# EAGLE board rose (EAGLE 7.5.0)
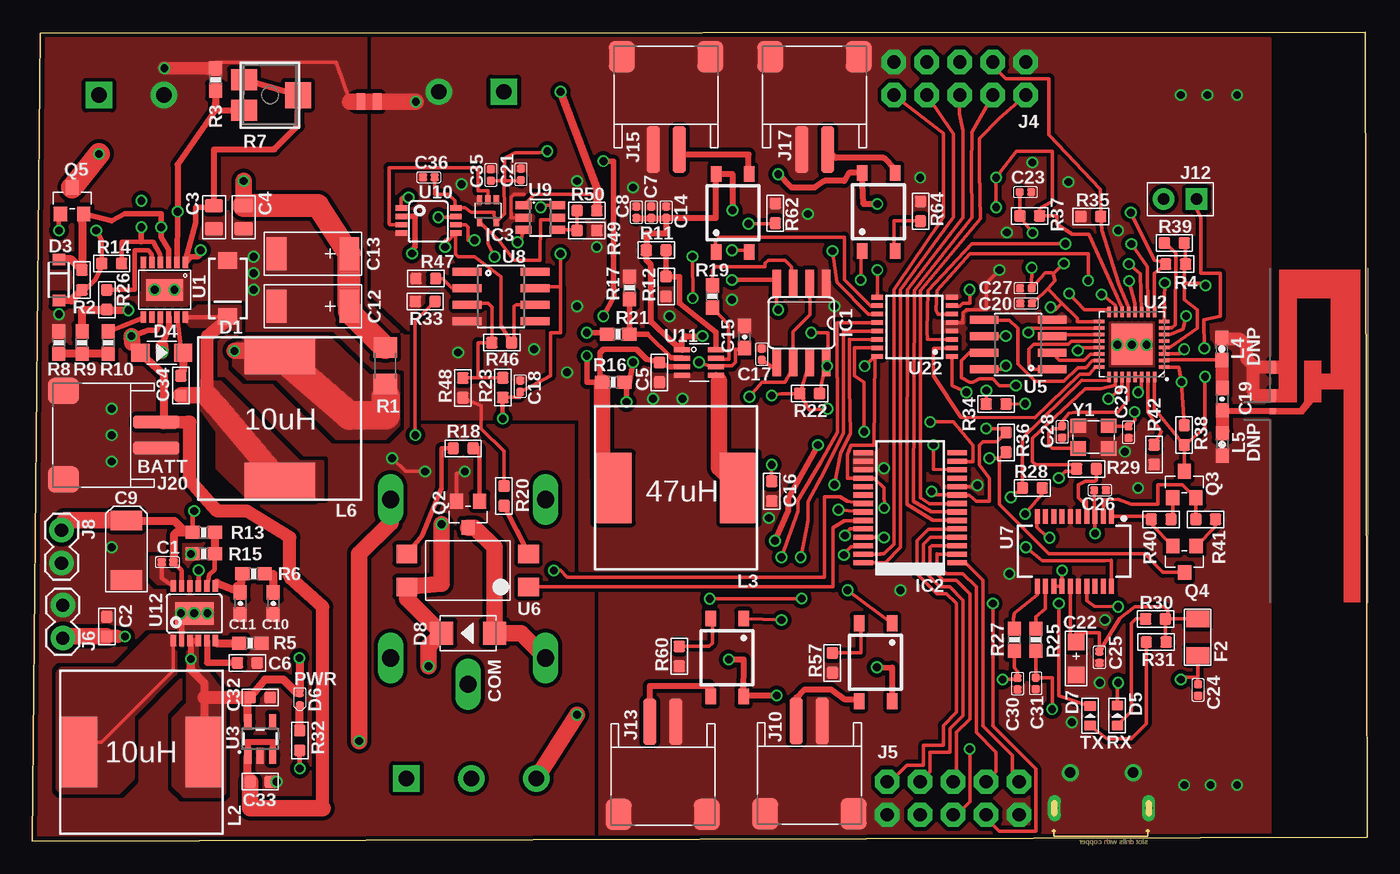
[diagram p2: board, top side]
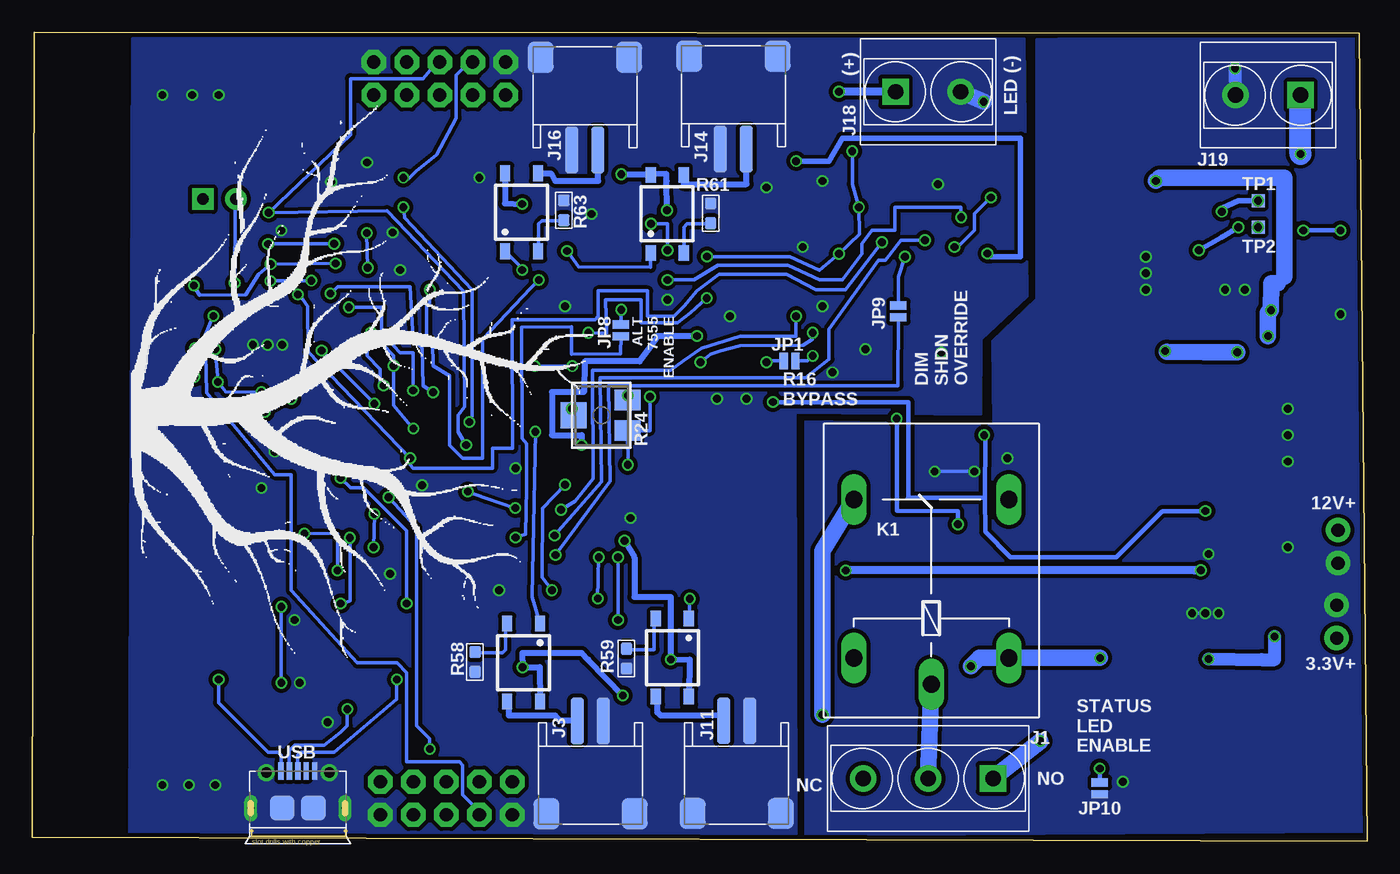
[diagram p3: board, bottom side, seen from below]

Size 102.72 x 62.22 mm. Coordinates in mm from the lower left corner, seen from the top.
Outline: 0,0 102.72,0.3 102.57,62.22 0.61,62.17 0,0
Copper layers (1*16): Top 0.035mm / dielectric 1.5mm / Bottom 0.035mm
Design rules "SeeedStudio_2layer_DRU_no_angle_20140221": minimum track width 6mil, minimum drill 12mil, track to track 6mil, track to pad 6mil, pad to pad 6mil, via to via 6mil, smd to smd 0mil, copper to edge 10mil, drill to drill 10mil, minimum pad ring 10mil, minimum via ring 6mil, stop-mask expansion 2mil, vias tented up to drill 100mil, thermal gap 10mil

## Footprints (pad centres in the part's own frame; a part is rotated, then mirrored left to right if it is on the bottom)
C0402 = smd 0.635 x 0.635: 1 0,0.445; 2 0,-0.445
C0603 = smd 0.889 x 0.889: 1 0,0.762; 2 0,-0.762
C0805 = smd 1.397 x 1.016: 1 0,0.889; 2 0,-0.889
EIA6032 = smd 1.5 x 2.4: P$1 -2.3,0; P$2 2.3,0
0603-CAP = smd 1.1 x 1: 1 -0.85,0; 2 0.85,0
AVX-C = smd 1.524 x 2.54: + -2.794,0; - 2.794,0
AVX-A = smd 1.27 x 1.27: + -1.27,0; - 1.27,0
SMA-DIODE = smd 1.27 x 1.47: A -2.15,0; C 2.15,0
SOD-123 = smd 0.9 x 0.95: A 1.575,0; C -1.575,0
SOD-123' = smd 1.397 x 1.397: + -1.651,0; - 1.651,0
LED-0603 = smd 0.762 x 0.889: + -0.762,0; - 0.762,0
LED-0402 = smd 0.58 x 0.58: + -0.468,0; - 0.468,0
DO-214AC = smd 1.8 x 1.77: 1 -2.042,0; 2 2.042,0
TRACE_ANTENNA_2.4GHZ_25.7MM = smd 0.46 x 0.46: ANT 0,0.23 | smd 1 x 0.46: GND -1.18,0.23; GND2 -3.38,0.23
F1206 = smd 1.27 x 1.778: 1 -1.397,0; 2 1.397,0
SO08 = smd 0.66 x 2.032: 1 -1.905,-3.073; 2 -0.635,-3.073; 3 0.635,-3.073; 4 1.905,-3.073; 5 1.905,3.073; 6 0.635,3.073; 7 -0.635,3.073; 8 -1.905,3.073
SSOP28 = smd 0.4 x 1.5: 1 -4.225,-3.625; 2 -3.575,-3.625; 3 -2.925,-3.625; 4 -2.275,-3.625; 5 -1.625,-3.625; 6 -0.975,-3.625; 7 -0.325,-3.625; 8 0.325,-3.625; 9 0.975,-3.625; 10 1.625,-3.625; 11 2.275,-3.625; 12 2.925,-3.625; 13 3.575,-3.625; 14 4.225,-3.625; 15 4.225,3.625; 16 3.575,3.625; 17 2.925,3.625; 18 2.275,3.625; 19 1.625,3.625; 20 0.975,3.625; 21 0.325,3.625; 22 -0.325,3.625; 23 -0.975,3.625; 24 -1.625,3.625; 25 -2.275,3.625; 26 -2.925,3.625; 27 -3.575,3.625; 28 -4.225,3.625
SC70-5 = smd 0.4 x 0.7: 1 -0.65,-0.85; 2 0,-0.85; 3 0.65,-0.85; 4 0.65,0.85; 5 -0.65,0.85
H3-5.0-15.5X8.0MM = drill 1.168 pad 2.032 square: 1 0,5 | drill 1.168 pad 2.032: 2 0,0; 3 0,-5
HW2-SMD-2.0-90D = smd 2 x 2.4: 3 3.4,-2.181; 4 -3.4,-2.181 | smd 1 x 3.6: + -1,4.953; - 1,4.953
2X5_NOSILK = drill 1.016 pad 1.88 octagon: 1 -1.27,5.08; 2 1.27,5.08; 3 -1.27,2.54; 4 1.27,2.54; 5 -1.27,0; 6 1.27,0; 7 -1.27,-2.54; 8 1.27,-2.54; 9 -1.27,-5.08; 10 1.27,-5.08
1X02 = drill 1.016 pad 1.88: 1 0,0; 2 2.54,0
H2-2.54 = drill 0.889 pad 1.651 square: 1 0,1.27 | drill 0.889 pad 1.651: 2 0,-1.27
H2-5.0-10.5X8.0MM = drill 1.168 pad 2.032 square: 1 0,2.5 | drill 1.168 pad 2.032: 2 0,-2.5
PAD-JUMPER-2-NO_NO_SILK = smd 0.635 x 1.27: 1 -0.45,0; 2 0.45,0
G5LE = drill 1.321 long: 1 -7.493,-5.969; 2 -7.493,5.969; O 4.699,5.969; P -9.525,0; S 4.699,-5.969
SRR1240 = smd 2.896 x 5.41: P$1 -4.851,0; P$2 4.851,0
0603 = smd 1.1 x 1: 1 -0.85,0; 2 0.85,0
2PT_GND_TIE = smd 1.27 x 0.635: P$1 0,0.635; P$2 0,-0.635
SOT-23 = smd 1.016 x 1.143: 1 -0.889,-1.016; 2 0.889,-1.016; 3 0,1.016
1206 = smd 1.6 x 1.8: 1 -1.4,0; 2 1.4,0
R0603 = smd 0.889 x 0.889: 1 0,0.762; 2 0,-0.762
0603-RES = smd 1.1 x 1: 1 -0.85,0; 2 0.85,0
ST4ETA = smd 2 x 1.6: P$1 2,-1.175; P$3 2,1.175 | smd 2 x 2: P$2 -2.15,0
TP10SQ = smd 1 x 1: TP 0,0
MSOP-12_GND = smd 0.889 x 0.42: 1 -2.1,1.625; 2 -2.1,0.975; 3 -2.1,0.325; 4 -2.1,-0.325; 5 -2.1,-0.975; 6 -2.1,-1.625; 7 2.1,-1.625; 8 2.1,-0.975; 9 2.1,-0.325; 10 2.1,0.325; 11 2.1,0.975; 12 2.1,1.625 | smd 1.651 x 2.845: 13 0,0
QFN32 = smd 0.8 x 0.285: 1 -2.5,1.75; 2 -2.5,1.25; 3 -2.5,0.75; 4 -2.5,0.25; 5 -2.5,-0.25; 6 -2.5,-0.75; 7 -2.5,-1.25; 8 -2.5,-1.75; 17 2.5,-1.75; 18 2.5,-1.25; 19 2.5,-0.75; 20 2.5,-0.25; 21 2.5,0.25; 22 2.5,0.75; 23 2.5,1.25; 24 2.5,1.75 | smd 0.285 x 0.8: 9 -1.75,-2.5; 10 -1.25,-2.5; 11 -0.75,-2.5; 12 -0.25,-2.5; 13 0.25,-2.5; 14 0.75,-2.5; 15 1.25,-2.5; 16 1.75,-2.5; 25 1.75,2.5; 26 1.25,2.5; 27 0.75,2.5; 28 0.25,2.5; 29 -0.25,2.5; 30 -0.75,2.5; 31 -1.25,2.5; 32 -1.75,2.5 | smd 3.15 x 3.15: EP 0,0
SOT23-5 = smd 0.55 x 1.2: 1 -0.95,-1.3; 2 0,-1.3; 3 0.95,-1.3; 4 0.95,1.3; 5 -0.95,1.3
SO08' = smd 0.61 x 2.21: 1 -1.905,-2.616; 2 -0.635,-2.616; 3 0.635,-2.616; 4 1.905,-2.616; 5 1.905,2.616; 6 0.635,2.616; 7 -0.635,2.616; 8 -1.905,2.616
SMD4-2.54-4.6X6.5MM = smd 1.4 x 1.6: 1 -1.27,-4.68; 2 1.27,-4.68; 3 1.27,4.68; 4 -1.27,4.68
SSOP20_L = smd 0.381 x 1.143: 1 -2.857,-2.68; 2 -2.223,-2.68; 3 -1.587,-2.68; 4 -0.953,-2.68; 5 -0.318,-2.68; 6 0.318,-2.68; 7 0.953,-2.68; 8 1.587,-2.68; 9 2.223,-2.68; 10 2.857,-2.68; 11 2.857,2.68; 12 2.223,2.68; 13 1.587,2.68; 14 0.953,2.68; 15 0.318,2.68; 16 -0.318,2.68; 17 -0.953,2.68; 18 -1.587,2.68; 19 -2.223,2.68; 20 -2.857,2.68
SOIC-8 = smd 0.61 x 2.21: 1 -1.905,-2.616; 2 -0.635,-2.616; 3 0.635,-2.616; 4 1.905,-2.616; 5 1.905,2.616; 6 0.635,2.616; 7 -0.635,2.616; 8 -1.905,2.616
TSOT-23-6 = smd 0.62 x 1.22: 1 -0.925,-1.325; 2 0.025,-1.325; 3 0.975,-1.325; 4 0.975,1.275; 5 0.025,1.275; 6 -0.925,1.275
TSSOP-8 = smd 0.419 x 0.889: 1 -0.975,-2.1; 2 -0.325,-2.1; 3 0.325,-2.1; 4 0.975,-2.1; 5 0.975,2.1; 6 0.325,2.1; 7 -0.325,2.1; 8 -0.975,2.1
TSOT-23-8 = smd 0.4 x 1.22: 1 -0.975,-1.31; 2 -0.325,-1.31; 3 0.325,-1.31; 4 0.975,-1.31; 5 0.975,1.31; 6 0.325,1.31; 7 -0.325,1.31; 8 -0.975,1.31
12MSOP = smd 0.419 x 0.889: 1 -1.61,-2.1; 2 -0.96,-2.1; 3 -0.31,-2.1; 4 0.34,-2.1; 5 0.988,-2.1; 6 1.635,-2.1; 7 1.635,2.1; 8 0.988,2.1; 9 0.34,2.1; 10 -0.31,2.1; 11 -0.96,2.1; 12 -1.61,2.1 | smd 2.946 x 1.75: 13 0.025,0
4-SOP = smd 0.8 x 1.2: 1 -1.143,-3.152; 2 1.397,-3.152; 3 1.397,2.848; 4 -1.143,2.848
TSSOP-16 = smd 0.9 x 0.35: 1 -2.697,2.453; 2 -2.697,1.803; 3 -2.697,1.153; 4 -2.697,0.503; 5 -2.697,-0.147; 6 -2.697,-0.797; 7 -2.697,-1.447; 8 -2.697,-2.097; 9 3.053,-2.097; 10 3.053,-1.447; 11 3.053,-0.797; 12 3.053,-0.147; 13 3.053,0.503; 14 3.053,1.153; 15 3.053,1.803; 16 3.053,2.453
MICRO-USB5+6P-SMD-0.65-AB = smd 0.4 x 1.35: 1 -1.3,2.875; 2 -0.65,2.875; 3 0,2.875; 4 0.65,2.875; 5 1.3,2.875 | smd 1.9 x 1.9: P1 -1.2,0; P2 1.2,0 | drill 0.508 pad 1.016 long: P3 -3.625,0; P4 3.625,0 | drill 0.8: P5 -2.425,2.73; P6 2.425,2.73
CRYSTAL-SMD-3.2X2.5 = smd 1.2 x 1.1: 1 -1.175,-0.875; 2 1.175,-0.875; 3 1.175,0.875; 4 -1.175,0.875

## Placement (x,y rotation side)
C1  100nf  [C0402]  10.39,21.46 270 top
C2  4.7uf  [C0603]  5.71,16.51 0 top
C3  10uf  [C0805]  13.97,48.01 180 top
C4  10uf  [C0805]  16.26,48.01 180 top
C5  1uf  [C0603]  48.26,36.07 180 top
C6  4.7uf  [C0603]  16.54,13.72 270 top
C7  1nf  [C0402]  47.62,48.39 0 top
C8  1nf  [C0402]  46.48,48.39 0 top
C9  68uF  [EIA6032]  7.24,22.38 270 top
C10  1.2nF  [0603-CAP]  18.54,18.29 270 top
C11  56pF  [0603-CAP]  16,18.29 270 top
C12  47uf  [AVX-C]  21.59,41.15 180 top
C13  47uf  [AVX-C]  21.59,45.21 180 top
C14  1nf  [C0402]  48.77,48.39 0 top
C15  .47uF 50V X7R  [0603-CAP]  54.81,38.79 90 top
C16  100pf  [C0603]  56.9,26.92 180 top
C17  10nf  [C0402]  56.13,37.47 0 top
C18  100NF 10V  [C0402]  37.54,35 180 top
C19  5.6pF  [0603-CAP]  91.57,34.01 270 top
C20  10uf  [C0402]  76.48,41.38 90 top
C21  100NF 10V  [C0402]  37.59,51.31 0 top
C22  10uf  [AVX-A]  80.34,14.05 270 top
C23  100nf  [C0402]  76.43,49.94 270 top
C24  100nf  [C0402]  89.71,11.63 180 top
C25  100nf  [C0402]  82.12,14.15 180 top
C26  100nf  [C0402]  82.17,27 270 top
C27  100nf  [C0402]  76.45,42.55 90 top
C28  10pf  [C0402]  79.25,31.5 180 top
C29  10pf  [C0402]  84.35,31.47 180 top
C30  47PF  [C0402]  75.82,12.12 0 top
C31  47PF  [C0402]  77.22,12.14 0 top
C32  1uf  [C0603]  17.53,11.05 270 top
C33  1uf  [C0603]  17.53,4.57 270 top
C34  1uf  [C0603]  11.43,35.05 0 top
C35  100NF 10V  [C0402]  35.28,51.26 0 top
C36  100NF 10V  [C0402]  30.51,51.08 270 top
D1  CMSH3-40MA  [SMA-DIODE]  15.04,42.52 270 top
D3  BZT52C10  [SOD-123]  2.03,43.18 270 top
D4  MMSD4148-sod123  [SOD-123']  9.96,37.59 0 top
D5  YELLOW-0603  [LED-0603]  83.49,9.68 90 top
D6  BLUE-0402  [LED-0402]  20.57,10.92 270 top
D7  GREEN-0603  [LED-0603]  81.41,9.65 90 top
D8  1N4007  [DO-214AC]  33.53,16 180 top
E1  ANTENNATRACE  [TRACE_ANTENNA_2.4GHZ_25.7MM]  95.25,33.1 270 top
F2  SMD1206R500SF  [F1206]  89.69,15.7 90 top
IC1  ICM7555  [SO08]  59.18,39.88 180 top
IC2  MCP23017SS  [SSOP28]  67.56,25.65 90 top
IC3  74AHC1G04DCK  [SC70-5]  35.05,48.51 180 top
J1  GREEN-3P-5.0  [H3-5.0-15.5X8.0MM]  33.78,4.83 270 bottom
J3  2P-2.0-90D-SMD  [HW2-SMD-2.0-90D]  59.77,4.29 0 bottom
J4  [2X5_NOSILK]  71.37,58.67 90 top
J5  [2X5_NOSILK]  70.87,3.3 270 top
J6  [1X02]  2.34,15.62 90 top
J8  [1X02]  2.24,23.93 270 top
J10  2P-2.0-90D-SMD  [HW2-SMD-2.0-90D]  59.79,4.29 0 top
J11  2P-2.0-90D-SMD  [HW2-SMD-2.0-90D]  48.51,4.32 0 bottom
J12  2p-2.54  [H2-2.54]  88.34,49.4 270 top
J13  2P-2.0-90D-SMD  [HW2-SMD-2.0-90D]  48.51,4.24 0 top
J14  2P-2.0-90D-SMD  [HW2-SMD-2.0-90D]  48.77,58.22 180 bottom
J15  2P-2.0-90D-SMD  [HW2-SMD-2.0-90D]  48.77,58.17 180 top
J16  2P-2.0-90D-SMD  [HW2-SMD-2.0-90D]  60.2,58.14 180 bottom
J17  2P-2.0-90D-SMD  [HW2-SMD-2.0-90D]  60.2,58.17 180 top
J18  GREEN-2P-5.0  [H2-5.0-10.5X8.0MM]  33.78,57.66 90 bottom
J19  GREEN-2P-5.0  [H2-5.0-10.5X8.0MM]  7.62,57.4 270 bottom
J20  2P-2.0-90D-SMD  [HW2-SMD-2.0-90D]  4.57,31.24 270 top
JP1  JUMPER-PAD-2-NO  [PAD-JUMPER-2-NO_NO_SILK]  44.45,36.96 0 bottom
JP8  JUMPER-PAD-2-NO  [PAD-JUMPER-2-NO_NO_SILK]  57.43,39.29 90 bottom
JP9  JUMPER-PAD-2-NO  [PAD-JUMPER-2-NO_NO_SILK]  36.07,40.77 90 bottom
JP10  JUMPER-PAD-2-NO  [PAD-JUMPER-2-NO_NO_SILK]  20.57,4.06 90 bottom
K1  G5LE  [G5LE]  33.53,21.59 90 bottom
L2  10uH  [SRR1240]  8.38,6.86 180 top
L3  47uH  [SRR1240]  49.53,27.18 0 top
L4  DNP  [0603]  91.54,37.87 90 top
L5  DNP  [0603]  91.57,30.53 270 top
L6  10uH  [SRR1240]  19.05,32.51 90 top
PT1  2PT_GND_TIE  [2PT_GND_TIE]  25.91,56.9 270 top
Q2  S8050  [SOT-23]  33.53,25.15 180 top
Q3  S9013  [SOT-23]  88.65,27.43 0 top
Q4  S9013  [SOT-23]  88.67,21.69 180 top
Q5  NCE3407A  [SOT-23]  3.05,49.28 0 top
R1  0.05  [1206]  27.15,36.58 90 top
R2  100K  [R0603]  3.81,43.18 180 top
R3  9.09K  [0603-RES]  14.1,58.6 270 top
R4  10K  [R0603]  87.99,44.4 90 top
R5  196k 0.1%  [0603-RES]  16.76,15.24 180 top
R6  154k  [0603-RES]  17.02,20.57 180 top
R7  100K  [ST4ETA]  18.29,57.4 180 top
R8  330k  [0603-RES]  2.03,38.35 270 top
R9  30k  [0603-RES]  3.81,38.35 90 top
R10  221k  [0603-RES]  5.84,38.35 270 top
R11  100K  [R0603]  48.01,45.47 270 top
R12  10K  [R0603]  48.77,42.67 0 top
R13  1.02M  [0603-RES]  13.18,23.75 180 top
R14  10K  [R0603]  6.1,44.45 270 top
R15  113k  [0603-RES]  13.18,22.1 0 top
R16  4.7  [0603-RES]  44.7,35.31 0 top
R17  16.5k  [0603-RES]  45.95,42.57 270 top
R18  510R  [R0603]  33.15,30.23 90 top
R19  9.09k  [0603-RES]  52.32,41.91 90 top
R20  1K  [R0603]  36.3,26.57 180 top
R21  453k  [0603-RES]  45.09,39.01 180 top
R22  30K  [R0603]  59.82,34.44 270 top
R23  3.3K  [R0603]  36.2,34.9 0 top
R24  100K  [ST4ETA]  58.93,32.77 0 bottom
R25  27  [0603-RES]  77.22,15.49 90 top
R26  10K  [R0603]  5.71,41.66 0 top
R27  27  [0603-RES]  75.57,15.49 90 top
R28  1K  [R0603]  76.96,27.18 270 top
R29  1K  [R0603]  81.13,28.65 270 top
R30  1K  [R0603]  86.44,17.09 90 top
R31  1K  [R0603]  86.49,15.32 90 top
R32  220R  [R0603]  20.57,7.75 180 top
R33  10K  [R0603]  30.23,41.53 270 top
R34  220R  [R0603]  74.17,33.63 90 top
R35  10K  [R0603]  81.46,48.06 90 top
R36  10K  [R0603]  74.93,30.68 180 top
R37  10K  [R0603]  76.76,48.11 270 top
R38  10K  [R0603]  88.65,31.24 180 top
R39  10K  [R0603]  87.88,46.02 90 top
R40  10K  [R0603]  86.87,24.77 90 top
R41  10K  [R0603]  90.3,24.77 90 top
R42  12K  [R0603]  86.33,29.74 0 top
R46  3.3K  [R0603]  36.12,38.35 90 top
R47  3.3K  [R0603]  30.28,43.28 270 top
R48  10K  [R0603]  33.12,34.87 180 top
R49  3.3K  [R0603]  42.67,46.99 90 top
R50  6.8K  [R0603]  42.67,48.51 90 top
R57  3.3K  [R0603]  61.57,13.72 180 top
R58  3.3K  [R0603]  68.66,13.79 180 bottom
R59  3.3K  [R0603]  57,14.05 180 bottom
R60  3.3K  [R0603]  49.78,14.22 180 top
R61  3.3K  [R0603]  50.52,48.31 0 bottom
R62  3.3K  [R0603]  57.18,48.31 0 top
R63  3.3K  [R0603]  61.82,48.54 0 bottom
R64  3.3K  [R0603]  68.35,48.46 0 top
TP1  TPTP10SQ  [TP10SQ]  8.38,49.28 90 bottom
TP2  TPTP10SQ  [TP10SQ]  8.38,47.24 90 bottom
U1  LT3652  [MSOP-12_GND]  10.16,42.42 270 top
U2  ESP8266  [QFN32]  84.61,38.23 180 top
U3  3.3V  [SOT23-5]  17.53,7.87 0 top
U5  AT25SF041-SOIC8  [SO08']  75.87,38.2 90 top
U6  LTV-816S  [SMD4-2.54-4.6X6.5MM]  33.5,20.83 90 top
U7  FTS31XS-U  [SSOP20_L]  80.19,22.3 180 top
U8  LTC6240  [SOIC-8]  36.07,41.91 270 top
U9  LT1783  [TSOT-23-6]  39.12,48.01 270 top
U10  74LVC2G02  [TSSOP-8]  30.48,47.75 270 top
U11  LT3469  [TSOT-23-8]  51.31,36.83 270 top
U12  LTC3122EP  [12MSOP]  12.45,17.53 0 top
U21  TLP170D  [4-SOP]  65.02,13.61 180 top
U22  74HC238  [TSSOP-16]  68.07,39.75 180 top
U23  TLP170D  [4-SOP]  64.8,13.59 180 bottom
U24  TLP170D  [4-SOP]  53.34,13.97 180 bottom
U25  TLP170D  [4-SOP]  53.59,13.97 180 top
U26  TLP170D  [4-SOP]  54,48.41 0 bottom
U27  TLP170D  [4-SOP]  53.77,48.49 0 top
U28  TLP170D  [4-SOP]  65.2,48.54 0 bottom
U29  TLP170D  [4-SOP]  65,48.56 0 top
U$1  [LEAF]  57.4,60.2 270 top
USB  ZX62-B-5PA  [MICRO-USB5+6P-SMD-0.65-AB]  82.3,2.54 0 bottom
Y1  26MHz  [CRYSTAL-SMD-3.2X2.5]  81.66,31.09 180 top

## Tracks (layer width: path | path; a pad name or v marks a point on that pad's centre or on a via)
3.3V_F  (via drill 0.6)
  Top 0.254: U7.13 U7.14 79.25,19.89 v79.25,20.83 | C26.2 81.75,25.01 U7.3 81.78,24.12 v81.79,23.67
  Bottom 0.254: v81.79,23.67 79.25,23.65 v79.25,20.83
!CHRG  (via drill 0.6)
  Top 0.356: R14.1 6.86,46.13 8.38,46.13 9.3,46.13 9.83,45.13 U1.4
  Top 0.406: TP2.TP 8.38,46.13
  other vias: 8.38,47.24
!FAULT
  Top 0.356: U1.5 9.2,44.51 9.2,45.16 8.89,45.47 7.87,45.47 7.87,42.42 R26.1
ADC  (via drill 0.6)
  Top 0.254: U2.6 87.63,38.99 88.53,39.38 v88.8,40.41
  Bottom 0.254: v88.8,40.41 89.41,38.91 89.31,34.52 84.07,28.19 82.8,28.19 82.8,19.3 77.72,13.72 74.65,13.72 73.91,12.95 73.91,6.1 69.85,6.1 69.6,5.84 69.6,3.56 68.33,2.29 J5.8
BOOST
  Top 0.356: C34.1 11.35,35.89 | D4.- 11.39,38.07 U1.11
  Top 0.61: D4.- 11.61,36.5 C34.1
CHIP_EN
  Top 0.254: R39.1 87.2,46.03 87.99,45.24 87.96,39.73 87.71,39.5 87.13,39.5 U2.7
D+  (via drill 0.6)
  Top 0.254: R27.1 75.57,13.34 75.82,13.08 C30.1 75.7,12.45 v74.68,12.45
  Bottom 0.254: USB.3 82.3,6.6 82.04,6.86 79.5,6.86 74.68,10.92 v74.68,12.45
D-  (via drill 0.6)
  Top 0.254: R25.1 C31.1 78.49,12.59 v78.49,10.16
  Bottom 0.254: USB.2 82.95,6.97 82.55,7.37 80.26,7.37 78.99,8.38 78.49,8.89 v78.49,10.16
DGND  (via drill 0.6)
  Top 0.254: U9.2 36.85,47.98 36.83,48.01 36.83,49.53 37.08,49.78 37.85,49.78 | U22.5 71.61,39.9 71.63,40.64 71.88,40.89 73.41,40.89 73.41,42.93 v74.42,43.94 | IC2.10 72.69,27.28 v72.72,27.38 | R20.2 36.3,30 34.54,31.75 34.54,33.5 R48.1
  Top 1.016: E1.GND2 94.08,36.48 | 94.08,36.48 93.47,37.08 93.47,38.1 92.96,38.61 91.91,38.61 L4.2 | 94.08,36.48 93.98,36.38 93.98,34.54 94.25,34.28 E1.GND
  Top 1.27: 25.02,56.9 PT1.P$2 v29.5,56.9
  Bottom 1.27: v29.5,56.9 J18.2
  other vias: 68.33,51.05 59.69,48.26 61.72,41.15 88.39,57.4 84.07,29.97 56.69,24.87 90.42,57.4 92.71,57.4 80.01,9.14 82.14,12.19 82.55,17.02 85.09,27.18 76.96,52.22 79.73,50.72 41.91,50.8 43.43,45.72 46.23,50.29 75.01,46.84 75.18,20.57 41.15,36.07 32.77,37.59 38.61,37.85 33.02,50.55 66.8,19.3 65.53,28.7 83.57,46.99 83.49,38.2 84.61,38.2 85.75,38.2 53.85,41.66 49.02,40.39 41.91,41.15 47.75,34.04 50.04,34.04 88.65,4.32 90.68,4.32 92.71,4.32
  pour Top (isolate 0.305, no thermals): 26.16,61.72 26.16,41.91 29.72,38.61 29.72,32.51 42.16,32.51 42.16,20.83 43.69,20.83 43.69,0 95.25,0.25 95.25,61.72
  pour Bottom (isolate 0.305, no thermals): 26.42,61.72 26.16,41.91 29.72,38.61 29.77,32.84 44.02,33.02 43.94,0.58 95.25,0.51 95,61.72
  pour Top (isolate 0.305, no thermals): 50.67,35.92 49.53,35.92 47.17,35.89 47.17,33.48 50.6,33.48
DTR
  Top 0.254: U7.1 85.89,24.98 R40.1 86.11,24.38 Q4.2
FB
  Top 0.61: R10.2 R9.1 R8.2
GND-ISO  (via drill 0.6)
  Top 0.254: 24.46,56.9 23.37,59.94 14.08,59.94 R3.1 | Q2.2 32.64,28.32 v33.27,28.45 | v30.23,28.45 28.7,28.45 v27.69,29.46
  Top 0.406: U12.2 11.49,17.47 v11.43,17.53
  Top 1.016: R3.1 13.98,59.45 13.46,59.44 v10.16,59.48
  Top 1.27: 25.27,56.9 24.46,56.9
  Bottom 0.254: v13.46,17.53 U12.13 | v33.27,28.45 v30.23,28.45
  Bottom 1.016: v10.16,59.48 J19.2
  other vias: 9.4,42.42 10.92,42.42 12.45,17.53 17.02,42.42 17.02,43.69 17.02,44.96 6.1,22.61 2.03,40.54 6.1,33.27 6.1,29.21 6.1,31.24 18.8,4.57 12.19,22.1
  pour Bottom (isolate 0.305, no thermals): 43.18,0.51 0.25,0.76 1.02,62.23 25.43,61.67 25.43,41.68 28.78,38.48 28.7,32 43.18,32.26
  pour Top (isolate 0.305, rank 2, no thermals): 13.21,47.5 13.21,46.48 13.72,46.48 13.97,46.48 13.97,43.69 13.97,42.42 15.75,42.42 17.78,39.88 22.61,39.88 22.61,44.96 20.83,47.24 20.83,47.5
  pour Top (isolate 0.305, rank 2, no thermals): 43.18,0.51 0.25,0.51 1.02,61.98 25.91,61.72 25.91,41.91 29.21,38.61 29.21,32 43.18,32.26
GPA0  (via drill 0.6)
  Top 0.254: v40.13,20.83 40.64,20.83 41.15,20.32 60.96,20.32 60.96,24.13 60.95,26.49 62.16,26.49 62.74,26.16 IC2.21
  Top 0.356: U12.9 12.8,19.64 v12.8,20.85
  Bottom 0.61: v12.8,20.85 13.28,20.83 v40.13,20.83
GPA1  (via drill 0.6)
  Top 0.254: U10.2 28.55,48.08 | IC2.22 63.99,25.3 v62.03,25.5
  Top 0.406: 28.55,48.08 29.46,48.08 29.46,45.72 29.21,45.47 v29.21,45.21 | v43.94,40.39 44.78,41.91 44.7,43.18 44.7,52.32 v43.94,52.32
  Bottom 0.254: v62.03,25.5 60.96,26.16 59.56,27.89 59.61,36.22 53.59,36.22 52.6,36.96 51.23,37.92 48.26,38.86 43.94,38.86 v43.94,40.39
  Bottom 0.406: v29.21,45.21 28.96,44.96 26.67,44.96 26.67,54.1 40.39,54.1 41.4,52.32 v43.94,52.32
GPA2
  Top 0.254: 63.9,24.64 62.48,24.64 61.62,24.11 61.62,19.56 U6.1
  Top 0.356: IC2.23 63.9,24.64
GPA3  (via drill 0.6)
  Top 0.254: IC2.24 62.92,24.03 v62.53,23.52 | v34.04,46.23 33.53,46.23 33.53,47.24 33.34,47.43 U10.6
  Bottom 0.254: v62.53,23.52 58.93,27.66 59.03,35.66 43.2,35.66 41.4,37.08 41.4,39.37 37.59,44.7 37.08,44.7 35.89,46.23 v34.04,46.23
GPA4  (via drill 0.6)
  Top 0.254: IC2.25 v65.53,23.37
  Bottom 0.254: v65.53,23.37 64.77,23.62 64.69,27.2 64.69,30.58 65.02,30.99 65.08,39.55 61.21,39.57 61.21,37.47 57.45,37.52 JP8.1
GPA5  (via drill 0.6)
  Top 0.254: IC2.26 63.87,22.66 62.99,22.66 62.41,22.12 v62.46,22.02
  Bottom 0.254: v62.46,22.02 58.27,27.69 58.39,35.05 36.09,35.05 36.09,35.3 | 36.09,35.23 36.09,35.3 | 36.09,35.3 JP9.1
GPA6
  Top 0.254: J4.1 70.1,54.46 70.1,48.01 66.29,42.42 66.29,22.86 65.53,22.1 65.28,22.1 65.26,22.08 IC2.27
GPA7
  Top 0.254: J4.3 70.89,54.43 70.87,48.01 66.8,42.42 66.8,22.61 65.63,21.44 65.38,21.44 65.19,21.43 IC2.28
GPB0
  Top 0.254: J5.1 75.44,5.08 75.44,6.6 73.15,8.89 73.15,20.07 71.79,21.43 IC2.1
GPB1
  Top 0.254: J5.3 74.17,5.33 74.17,6.86 72.64,8.38 72.64,19.56 71.63,20.57 70.36,20.57 69.6,21.34 69.6,22.1 69.62,22.08 IC2.2
GPB2
  Top 0.254: J5.5 71.12,4.83 71.12,8.38 72.14,9.4 72.14,19.05 71.12,20.07 70.1,20.07 69.09,21.08 69.09,22.61 69.21,22.73 IC2.3
GPB3
  Top 0.254: J5.7 69.09,5.33 69.09,6.86 70.61,6.86 70.61,8.64 71.63,9.65 71.63,18.54 70.61,19.56 69.85,19.56 68.58,20.83 68.58,22.86 69.1,23.38 IC2.4
GPB4
  Top 0.254: IC2.5 71.16,24 68.96,24 68.07,23.11 68.07,20.57 69.6,19.05 70.36,19.05 71.12,18.29 71.12,9.91 70.1,8.89 70.1,7.37 68.58,7.37 68.58,5.84 67.31,5.84 66.04,4.57 J5.9
GPB5
  Top 0.254: J4.5 71.35,55.96 71.6,54.69 71.63,52.32 71.6,47.96 67.34,42.42 67.31,25.91 69.3,24.68 IC2.6
GPB6
  Top 0.254: J4.7 72.29,54.56 72.26,51.74 72.31,47.98 67.87,42.39 67.82,26.16 69.18,25.33 IC2.7
GPB7
  Top 0.254: J4.9 74.42,55.63 72.9,54.05 72.9,51.56 72.97,47.88 68.35,42.34 68.33,26.42 69.02,25.98 IC2.8
GPIO0  (via drill 0.6)
  Top 0.254: U2.15 83.33,41.23 v82.3,42.06 | v73.66,29.46 74.47,29.46 | 74.47,29.46 R36.1 | Q4.3 87.02,20.68 85.6,22.1 78.23,22.1 74.42,25.91 74.42,29.41 74.47,29.46 | U9.3 37.59,46.32 v37.34,46.08
  Bottom 0.254: v82.3,42.06 81.99,41.81 81.53,41.15 81.51,37.64 v73.66,29.46 73.66,28.96 73.41,28.7 67.31,28.7 67.31,30.23 65.76,30.23 65.79,40.13 59.44,40.13 59.18,40.39 59.18,42.34 55.37,42.34 55.37,40.39 53.34,40.39 52.58,41.15 51.56,42.34 49.86,43.64 44.68,43.64 42.42,42.42 40.13,42.42 v37.34,46.08
GPIO2  (via drill 0.6)
  Top 0.254: U2.14 83.86,41.09 81.31,46.71 80.02,46.7 78.84,47.47 78.84,48.11 R37.1 77.5,48.67 78.49,49.23 78.49,53.09 75.72,53.09 v74.17,51.05 v74.17,48.77 | v69.09,32.26 70.87,32.26 72.39,30.48 72.39,29.21 71.97,29.21 IC2.13
  Bottom 0.254: v74.17,48.77 74.09,47.96 68.89,42.44 68.89,32.72 v69.09,32.26 | v74.17,51.05 73.79,50.98 73.2,51.54 71.63,52.83 70.1,55.63 70.1,58.93 69.09,59.94 J4.4
GPIO4  (via drill 0.6)
  Top 0.254: v71.88,34.54 70.81,35.03 70.77,35.06 U22.1 | v79.78,42.14 80.95,40.89 82.87,40.89 U2.16
  Bottom 0.254: v79.78,42.14 79.25,42.67 73.66,42.67 73.41,38.61 72.72,37.92 72.64,35.05 v71.88,34.54
GPIO5
  Top 0.254: U2.24 81.79,36.48 81.33,35.92 80.62,35.94 77.14,32.59 71.45,32.61 69.34,35.81 69.34,37.9 69.37,37.92 70.49,37.92 U22.2
GPIO12  (via drill 0.6)
  Top 0.254: U22.3 68.87,38.62 68.86,39.22 68.94,42.37 72.29,45.97 v79.5,45.97 | v84.58,45.95 85.83,44.2 U2.10
  Bottom 0.254: v79.5,45.97 v84.58,45.95
GPIO13  (via drill 0.6)
  Top 0.254: U22.6 69.69,40.55 69.52,40.84 69.6,42.34 72.16,45.21 81.28,45.21 81.28,44.37 v81.26,43.13 | v84.4,43.1 84.84,41.4 84.84,40.75 U2.12
  Bottom 0.254: v81.26,43.13 v84.4,43.1
GPIO14  (via drill 0.6)
  Top 0.254: U2.9 86.36,43.69 R4.1 87.22,44.6 86.72,44.6 86.36,44.7 v84.53,48.36 | v69.34,30.48 69.34,29.46 69.34,28.6 IC2.12
  Bottom 0.254: v69.34,30.48 69.98,31.5 69.98,32.77 69.47,33.43 69.52,42.32 75.44,48.51 v84.53,48.36 78.23,54.36 78.23,58.67 72.64,58.67 71.37,60.2 J4.6
GPIO15
  Top 0.254: U2.13 84.36,41.12 83.62,42.85 82.33,46.99 R35.2 82.19,50.16 78.23,54.36 78.23,58.67 74.93,58.67 73.91,59.69 J4.8
GPIO16  (via drill 0.6)
  Top 0.254: U2.8 87.11,41.64 v87.15,42.95
  Bottom 0.254: v87.15,42.95 87.12,48.59 J12.2
LED_COM
  Bottom 1.27: J1.2 K1.P
LED_DIM+  (via drill 0.6)
  Top 0.254: U9.1 38.64,49.78 43.43,49.78
  Top 0.61: v40.64,57.66 43.43,50.25 43.43,49.78 R50.2
  Bottom 0.61: J18.1 v40.64,57.66
LED_NC  (via drill 0.6)
  Top 1.27: J1.3 v41.91,9.73
  Bottom 1.27: v41.91,9.73 41.91,22.35 K1.O
LED_NO  (via drill 0.6)
  Top 1.27: v25.15,7.7 25.15,22.1 27.56,24.51 K1.S
  Bottom 1.27: J1.1 v25.15,7.7
LNA
  Top 0.254: U2.2 87.15,37.02 L4.1
  Top 1.016: L4.1 91.54,34.89 C19.1
LNA2
  Top 0.254: 91.85,31.41 L5.1
  Top 0.457: E1.ANT 91.89,33.1 C19.2
  Top 0.61: 91.82,31.56 L5.1
  Top 1.016: C19.2 L5.1
N$1
  Top 0.254: U2.31 85.85,33.02 86.87,31.52 R42.1
N$2  (via drill 0.6)
  Top 0.356: 3.94,48.01 Q5.2 3.81,47.62
  Top 0.406: C3.2 13.86,48.78 12.55,48.78 12.55,47.6 11.79,44.78 U1.1 12.22,44.96 12.7,44.96 12.95,45.21 v12.95,45.47 | U1.3 10.48,45.52 9.91,46.48 v9.91,47.24 9.91,48.26 7.11,48.26 6.1,47.75 Q5.2
  Top 0.457: C3.2 13.97,53.22 18.6,53.22 20.42,55.04 R7.P$2 R7.P$1
  Top 0.61: D3.C 3,44.76 R2.2 3.81,47.62
  Bottom 0.406: v9.91,47.24 11.18,46.48 v12.95,45.47
N$3
  Top 0.356: U1.7 8.53,40.26 6.91,39.62 R10.1
N$5
  Top 0.356: U6.2 R20.1
N$6  (via drill 0.6)
  Top 0.356: Q5.1 2.03,47.62 v2.03,46.99 | v4.9,46.99 5.33,46.23 R14.2 5.33,44.2 4.83,43.18 4.06,42.42 R2.1
  Top 0.61: R2.1 3,41.61 D3.A
  Bottom 0.356: v2.03,46.99 v4.9,46.99
N$7  (via drill 0.6)
  Top 0.254: IC1.7 R22.2 | v56.9,34.29 57.66,34.44 R22.2 | R22.2 59.79,33.17 v61.21,33.27
  Bottom 0.254: 56.93,34.32 v56.9,34.29 56.9,33.97 R24.P$3 | v61.21,33.27 61.47,33.66 R24.P$2
N$8
  Top 0.254: U2.28 84.33,35.7 84.33,33.93 83.54,33.02 80.26,33.02 79.76,32.92 79.25,32.26 C28.2 79.06,31.75 78.49,31.75 78.23,31.5 78.23,30.48 78.5,30.21 Y1.3
N$9
  Top 0.356: D8.1 35.56,16.01
  Top 1.27: K1.2 37.59,16 D8.1 | 35.56,16.01 35.56,22.61 34.04,24.13 Q2.3
N$10
  Top 0.457: J10.+ 58.79,11.04 59.44,11.68 61.47,11.68 62.48,10.92 63.47,10.92 U21.3
N$12  (via drill 0.6)
  Top 0.254: IC1.2 59.84,40.51 58.55,39.19 IC1.6 | 58.55,36.7 IC1.6 | v55.19,34.19 56.13,35.31 57.91,35.31 58.67,36.68 IC1.6 | C16.2 v56.9,28.96
  Bottom 0.254: R24.P$1 55.2,31.59 v55.19,34.19 | 56.9,32.26 R24.P$1 | v56.9,28.96 R24.P$1
N$13
  Top 0.356: U6.3 29.97,23.5 31.5,27.18 31.5,30.23 R18.1
N$14
  Top 0.254: C17.2 57.28,36.26 IC1.5
N$15
  Top 0.356: Q2.1 34.42,30.23 R18.2
N$16  (via drill 0.6)
  Top 0.254: Y1.1 82.89,31.91 C29.2 84.84,32.4 v84.84,33.02 | U2.27 83.86,34.84 v82.8,34.04
  Bottom 0.254: 83.06,34.29 v82.8,34.04 v84.84,33.02
N$17
  Top 0.254: U12.1 10.84,13.12 5.33,7.62 3.79,7.62 3.53,7.37
  Top 0.61: 3.53,7.87 3.53,7.37 L2.P$2
  pour Top (isolate 0.406, no thermals): 10.92,15.75 10.92,12.95 7.62,9.65 7.62,4.83 6.6,3.81 2.29,3.81 2.03,4.06 2.03,12.95 2.29,13.21 6.6,13.21 9.14,15.75
N$18
  Top 0.406: U12.6 14.15,15.24
  Top 0.61: 14.15,15.24 R5.2
N$19
  Top 0.406: U12.5 13.46,15.4
  Top 0.457: 13.46,15.4 13.46,13.72
  Top 0.508: 13.46,13.72 C6.2
N$20  (via drill 0.6)
  Top 0.254: U8.6 37.21,41.28 37.08,41.15 37.08,38.56 R46.2 36.07,39.68 36.07,43.43 34.04,44.96 32.77,44.96 32.58,45.14 U10.5 32.03,46.23 31.75,46.23 v31.75,45.72 | v28.96,49.53 28.45,49.53 28.38,49.46 U10.1
  Bottom 0.254: v31.75,45.72 31.75,45.47 30.23,46.99 30.23,48.26 v28.96,49.53
N$21
  Top 0.356: C1.2 9.95,20.24 U12.12
  pour Top (no thermals): 10.92,19.81 10.92,20.57 10.67,20.57 10.16,21.08 10.16,21.84 9.14,21.84 9.14,20.32 9.65,19.81
N$22
  Top 0.406: U12.7 14.18,19.9
  Top 0.61: C11.1 15.73,19.63 | 14.18,19.9 C11.1 | C11.1 R6.2
N$23
  Top 0.356: U12.8 13.46,19.65 13.61,20.5 14.03,20.89 R15.2
  Top 0.61: R13.1 R15.2
N$24
  Top 0.61: R6.1 18.54,20.57 C10.1
N$25
  Top 0.457: U11.5 52.62,35.77 52.83,35.43
  Top 1.27: 52.83,35.43 52.83,28.73 L3.P$2
N$26  (via drill 0.6)
  Top 0.254: R16.1 43.69,35.47
  Top 0.406: U11.3 48.95,36.51 C5.2 47.24,37.08 46.48,37.85 43.94,37.85 43.69,37.59 43.69,35.47 | v42.67,37.34 42.67,35.31 R16.1
  Top 1.27: R16.1 43.85,28 L3.P$1
  Bottom 0.254: v42.67,37.34 43.05,36.96 JP1.2
N$27
  Top 0.406: R11.1 R12.1 49.78,43.43 49.78,41.4 52.62,39.16 U11.8
N$29
  Top 0.254: U11.7 52.69,37.08 53.59,37.08 53.59,38.35 53.56,39.74 R19.1
N$30  (via drill 0.6)
  Top 0.254: C15.1 54.93,37.83 54.1,37.85 54.1,36.83 53.85,36.58 52.69,36.58 U11.6 52.55,36.58 52.07,36.58 v51.31,36.86 | R21.2 44.13,39.12
  Top 0.406: 44.13,39.12 v42.67,39.12
  Bottom 0.254: v42.67,39.12 42.67,38.61 43.41,38.15 48.26,38.12 49.71,37.74 50.55,37.47 v51.31,36.86
N$31
  Top 0.254: R21.1 45.95,39
  Top 0.305: 47.36,39 49.17,37.19
  Top 0.406: R17.2 45.95,39 47.36,39 | 49.17,37.19 49.97,37.19 U11.2
N$32
  Top 0.254: R31.1 85.73,9.02 84.58,7.87 82.68,7.87 D7.+
N$33
  Top 0.254: R30.1 84.91,17.09 84.58,16.76 84.58,10.01 D5.+
N$34
  Top 0.254: U7.12 77.97,17.89 77.22,17.27 R25.2
N$35
  Top 0.254: U7.11 77.33,18.96 75.57,17.55 75.51,17.11 R27.2
N$36
  Top 0.61: R32.2 D6.-
N$37  (via drill 0.6)
  Top 0.356: v20.57,5.59 R32.1
  Bottom 0.356: JP10.2 v20.57,5.59
N$38
  Top 0.254: Q3.1 87.76,24.89 R40.2
N$39
  Top 0.254: R41.2 91.06,24.21 Q4.1
N$43
  Top 0.254: R57.2 63.75,14.48 63.75,16.76 U21.2
N$45
  Bottom 0.254: J11.+ 49.48,9.68
  Bottom 0.457: 49.48,9.68 51.05,9.65 54.36,9.65 54.61,9.91 54.61,11 U24.3
N$46
  Bottom 0.254: U24.2 54.86,17.02 54.86,14.73 56.9,14.73 R59.2
N$47
  Bottom 0.254: 66.04,10.59 U23.3
  Bottom 0.457: J3.+ 62.1,9.27 62.48,9.65 66.04,9.65 66.04,10.59
N$48
  Bottom 0.254: R58.2 68.58,14.48 66.55,14.48 66.29,14.73 66.29,16.51 U23.2
N$49
  Top 0.254: 52.32,11.68 52.07,11.94 | 47.5,9.4 J13.+ | 52.32,11.18 U25.3
  Top 0.457: 47.5,9.4 47.5,11.94 52.07,11.94 | 52.32,11.18 52.32,11.68
N$50
  Top 0.254: R60.2 52.07,14.99 52.32,15.24 52.32,17.02 U25.2
N$51
  Bottom 0.254: 47.75,53.09 J14.+ | 52.58,51.05 U26.3
  Bottom 0.406: 52.58,51.05 52.58,50.55
  Bottom 0.457: 47.75,53.09 47.75,50.55 52.58,50.55
N$52
  Bottom 0.254: R61.2 50.55,47.5 52.32,47.5 52.58,47.24 52.58,45.47 U26.2
N$53
  Top 0.254: 49.78,52.83 J15.+ | 55.12,51.56 U27.3
  Top 0.457: 49.78,52.83 55.12,52.83 55.12,51.56
N$54  (via drill 0.6)
  Top 0.254: v53.85,45.47 55.12,45.47 U27.2 | v55.12,47.5 57.15,47.5 R62.2
  Bottom 0.254: v53.85,45.47 53.85,47.5 v55.12,47.5
N$55
  Bottom 0.254: 59.18,51.56 59.18,53.17 J16.+
  Bottom 0.457: U28.3 62.82,51.39 62.48,50.8 59.18,50.8 59.18,51.56
N$56
  Bottom 0.254: R63.2 61.98,47.75 63.5,47.75 63.75,47.5 63.75,45.47 U28.2
N$57
  Top 0.457: U29.3 66.4,51.71 65.53,52.58 61.83,52.58 J17.+
N$58
  Top 0.254: U29.2 66.29,45.47 66.29,47.75 68.33,47.75 R64.2
N$59
  Top 0.254: U8.3 33.58,41.4 35.05,41.4 35.36,41.1 R46.1 34.29,38.35 34.29,35.64 | R23.1 36.17,35.64 34.29,35.64 | R48.2 34.29,35.64
N$60
  Top 0.254: U8.2 33.43,42.57 32.26,42.57 31.55,43.28 R47.1
N$64
  Top 0.254: R50.1 R49.1 41.87,47.03 U9.4
N$65
  Top 0.254: IC3.2 35.05,50.04 34.29,50.04 34.29,51.82 27.43,51.82 27.43,47.5 27.5,47.43 U10.3
N$67  (via drill 0.6)
  Top 0.254: U9.5 39.91,47.8 39.09,47.8 39.06,44.7 37.08,44.7 36.2,45.85 35.94,46.15 34.43,47.66 IC3.4 34.4,47.62 35.03,46.99 35.05,45.97 v35.56,44.96
  Bottom 0.254: v35.56,44.96 36.07,43.43 36.07,42.16 JP9.2
PIEZO_DRIVE  (via drill 0.6)
  Top 0.254: U11.1 50.04,37.85 | 52.58,51.31 U27.4 | 54.79,11.18 U25.4
  Top 0.457: C8.2 C7.2 C14.2 | C14.2 48.78,46.74 47.24,46.74 R11.2 47.24,44.7 47.6,44.35 47.6,39.95 49.02,38.57 U11.1 50,38.57 50.29,38.86 v51.56,38.86 | 52.58,51.31 52.58,47.93 C14.2 | U27.4 53.88,51.34 v53.87,48.54 | v65.02,49.02 63.96,49.02 U29.4 62.84,51.41 62.48,50.8 60.96,50.8 60.2,50.29 58.42,50.29 v57.4,51.31 | v57.28,11.2 54.79,11.18 | U25.4 54.76,13.97 v53.59,13.97 | v60.45,30.48 58.14,26.34 58.17,25.4 v57.15,23.11 | v65,13.39 66.17,13.36 U21.4
  Bottom 0.254: 63.75,10.84 U23.4 | 55.11,51.31 U26.4 55.09,51.31 55.11,51.31
  Bottom 0.457: v53.87,48.54 53.9,50.8 53.92,51.33 55.11,51.31 v57.4,51.31 | U28.4 66.34,49.07 v65.02,49.02 | v57.28,11.2 59.94,13.97 60.45,14.48 65.02,14.48 v65,13.39 63.68,13.38 U23.4 | U24.4 52.15,13.99 v53.59,13.97 53.59,18.8 56.39,18.8 56.39,21.84 v57.15,23.11 | v51.56,38.86 54.61,38.86 55.12,38.1 55.98,36.91 60.22,36.91 60.27,34.54 62.74,34.54 62.74,31.24 60.45,31.24 v60.45,30.48
PIEZO_EN  (via drill 0.6)
  Top 0.254: U10.7 32.51,48.01 v31.24,48.01 | v57.4,40.89 57.28,41.02 IC1.4
  Top 0.356: v53.85,43.18 57.3,43.18 57.28,42.8 IC1.4
  Bottom 0.254: v31.24,48.01 31.24,48.77 36.32,48.77 36.32,46.99 38.1,46.99 38.86,45.97 38.86,45.21 40.39,43.18 42.16,43.18 44.58,44.3 49.96,44.3 51.82,43.18 v53.85,43.18 | JP8.2 57.4,39.77 v57.4,40.89
PIEZO_PWM
  Top 0.254: R19.2 52.32,43.94 52.58,44.2 56.39,44.2 56.39,44.45 56.64,44.7 57.91,44.7 58.42,44.2 58.42,43.08 IC1.3
RESET  (via drill 0.6)
  Top 0.254: U2.32 86.36,33.28 R38.1 | J12.1 89.61,48.57 89.92,48.01 89.92,43.69 91.44,43.69 91.44,40.39 90.17,40.13 v90.2,37.92 | v90.25,35.74 90.25,31.77 R38.1 | R38.1 Q3.3
  Bottom 0.254: v90.2,37.92 v90.25,35.74
RTS
  Top 0.254: R41.1 Q3.2 88.52,27.43 86.61,27.43 86.61,25.91 84.58,25.91 83.54,26.29 82.41,26.28 U7.2
RXD
  Top 0.254: R29.1 81.89,27.79 81.79,27.69 81.03,27.69 80.52,27.43 80.52,26.42 80.77,26.16 81.13,26.16 81.13,24.99 U7.4
RXLED  (via drill 0.6)
  Top 0.254: D5.- 83.49,11.86 v83.57,12.19 | v83.57,18.03 81.74,18.06 81.15,18.52 81.15,19.46 U7.17
  Bottom 0.254: v83.57,12.19 v83.57,18.03
SD_!HD!  (via drill 0.6)
  Top 0.254: U5.7 72.11,37.57 71.5,36.96 71.5,35.64 72.14,35.31 72.39,35.31 72.9,35.56 73.91,35.56 74.42,35.05 v75.69,35.05 | v76.66,39.14 76.71,39.47 82.03,39.47 U2.18
  Top 0.406: 73.25,37.59 U5.7
  Bottom 0.254: v75.69,35.05 75.95,35.31 75.95,36.32 76.96,37.34 76.96,38.61 v76.66,39.14
SD_!WP!
  Top 0.254: U2.19 78.63,38.98 U5.3
SD_CLK  (via drill 0.6)
  Top 0.254: U5.6 74.91,38.84 v74.93,38.86 | v73.43,34.67 R34.1
  Bottom 0.254: v74.93,38.86 74.93,38.1 74.42,37.59 73.43,37.59 v73.43,34.67
SD_CLK0  (via drill 0.6)
  Top 0.254: U2.21 80.73,37.98 v80.47,37.74 | v76.4,33.66 R34.2
  Bottom 0.254: v80.47,37.74 v76.4,33.66
SD_CS0
  Top 0.254: U2.20 79.98,38.48 79.73,38.23 77.09,38.23 76.71,37.85 76.71,36.58 76.96,36.32 78.46,36.32 U5.1
SD_SI
  Top 0.254: U2.23 81.58,36.98 81.08,36.42 80.47,36.42 79.38,35.38 77.19,35.38 75.84,36.73 75.84,39.45 75.21,40.08 73.28,40.08 U5.5
SD_SO
  Top 0.254: U2.22 81.42,37.48 80.95,37.01 79.05,37.01 U5.2
SENSE  (via drill 0.6)
  Top 0.356: 24.38,32.77 24.41,32.74 | U1.10 | 17.09,37.74 16.71,37.36 L6.P$2
  Top 0.457: U1.10 10.49,39.62 9.96,38.1
  Top 1.016: 9.96,38.1 v9.98,37.62
  Top 1.27: R1.1 27.18,34.19 | v15.54,37.72 17.09,37.74
  Top 2.184: 27.18,34.19 27.18,32.77 24.38,32.77 | 24.41,32.74 L6.P$2
  Bottom 0.61: 15.42,37.64 v15.54,37.72
  Bottom 1.27: v9.98,37.62 12.57,37.62 15.42,37.64
  pour Top (isolate 0.406, no thermals): 16.74,38.79 16.46,38.76 16.26,38.61 16.26,38.35 15.75,38.35 15.49,38.1 15.49,36.58 16.51,35.56 18.8,35.56 23.37,30.99 27.18,30.99 28.19,32 28.19,35.81 25.91,35.81 22.83,38.79
SET  (via drill 0.6)
  Top 0.406: U1.2 11.12,44.42 v11.18,48.44 | R3.2 14.12,57.35
  Top 0.457: 14.12,57.35 14.12,56.24 16.21,56.22 R7.P$3 | R3.2 13.99,56.13 11.18,52.07 v11.18,48.44
  Bottom 0.406: v11.18,48.44 11.18,48.69 9.91,49.28 TP1.TP
  other vias: 8.38,49.28
SW
  Top 0.356: D1.C 14.17,40.32 U1.12
  Top 0.61: 14.99,40.13 D1.C
  Top 1.016: 13.46,34.29 13.46,38.86 14.99,40.13
  Top 1.27: 13.46,34.29 C34.2
  Top 1.676: L6.P$1 14.12,33.5 13.46,34.29
  pour Top (isolate 0.305, no thermals): 11.68,40.64 11.68,40.13 12.19,39.62 13.46,39.62 13.72,39.37 16,39.37 16,41.15 12.7,41.15 12.19,40.64
  pour Top (isolate 0.406, no thermals): 12.8,35.41 12.83,33.43 14.22,31.5 14.22,28.7 16.51,26.42 22.35,26.42 22.35,29.21 20.57,29.21 14.48,35.31
TXD  (via drill 0.6)
  Top 0.254: U7.20 83.05,21.6 82.55,21.59 77.72,21.59 v76.45,22.61 | v76.4,25.17 77.67,26.7 R28.1
  Bottom 0.254: v76.45,22.61 v76.4,25.17
TXLED  (via drill 0.6)
  Top 0.254: U7.10 77.32,24.97 77.32,24.15 78.11,23.37 v78.28,23.34 | v78.99,18.29 78.99,11.18 81.28,10.41 D7.-
  Bottom 0.254: v78.28,23.34 78.28,18.52 78.74,18.29 v78.99,18.29
U0RXI  (via drill 0.6)
  Top 0.254: U2.25 82.86,35.46 82.83,35.43 80.79,35.45 76.2,30.99 R28.2 v75.31,26.47 | v72.14,7.09 72.14,3.05 71.12,2.03 J5.6
  Bottom 0.254: v75.31,26.47 73.15,24.13 73.15,8.89 72.14,7.87 v72.14,7.09
U0TXO  (via drill 0.6)
  Top 0.254: U2.26 83.36,35.1 82.22,34.8 81.03,34.8 76.96,30.99 76.96,29.21 77.22,28.96 80.39,28.96 R29.2 80.37,28.55 80.26,28.45 79.5,28.45 v78.99,27.94 | v73.91,18.29 73.91,8.89 77.22,5.59 77.22,0.76 74.42,0.76 73.41,1.78 J5.4
  Bottom 0.254: v78.99,27.94 78.23,27.18 77.22,27.18 73.91,23.88 v73.91,18.29
USBVCC
  Top 0.254: U7.15 79.87,15.33 C22.+ 80.3,16.04 82.12,16.03 C25.2 83.68,17.13 84.84,18.03 87.12,18.03 87.38,17.78 87.38,17.27 R30.2 | R30.2 87.2,15.37 R31.2 | F2.2 R30.2
V12_REG  (via drill 0.6)
  Top 0.254: R33.1 29.46,40.01 v29.46,31.24 | 45.95,35.32 R16.2 45.72,35.31
  Top 0.356: 10.92,21.55 C1.1 11.43,20.87 11.43,20.83 11.49,20.77 U12.11 | 10.92,23.62 11.05,23.75 | C9.P$1 6.26,24.64 | 11.81,23.75 R13.2 12.33,25.29 v12.45,25.4
  Top 0.406: 45.95,35.32 v46.23,36.86 | v45.72,33.78 45.72,35.31
  Top 0.61: 10.92,21.55 10.92,23.62 | 11.05,23.75 R13.2 | 6.26,24.64 10.92,24.64 11.81,23.75
  Top 1.27: J8.1 2.48,24.68 C9.P$1
  Bottom 0.254: v46.23,36.86 46.1,36.96 JP1.1 | 29.39,31.17 v29.46,31.24
  Bottom 0.356: 29.41,26.44 29.36,23.8 27.43,21.84 19.3,21.84 15.75,25.4 v12.45,25.4 | v45.72,33.78 35.31,33.78 35.31,26.39 35.33,26.39 35.33,26.44 29.41,26.44 | 29.41,26.44 29.39,31.17
V_BATT  (via drill 0.6)
  Top 0.356: U3.3 18.54,6.64 | 16.51,7.62 16.58,7.55 | 12.12,32.23 11.92,32.24 | 10.08,32.17 J20.+ | 24.38,40.75 C12.+ | R9.2 3.81,39.46
  Top 0.406: U1.9 9.83,39.8 9.58,39.32 8.91,39.32 v7.62,38.86
  Top 0.457: 18.54,6.64 18.54,7.62 16.51,7.62 | 16.58,7.55 U3.1
  Top 0.61: C33.2 16.58,4.76 U3.1 | D4.+ 10.08,35.94 10.08,32.17 | 3.81,39.46 3.81,40.89 R26.2 v7.39,40.84
  Top 1.016: 22.35,2.54 22.35,18.03 19.81,20.32 19.81,23.37 16.51,25.4 14.22,25.4 12.12,27.79 12.12,32.23 | 11.92,32.24 10.08,32.17 | 7.67,38.35 D4.+
  Top 1.27: v7.62,38.86 7.67,38.35 | C4.2 v16.26,50.8 | 22.35,2.54 16.76,2.54 C33.2
  Top 1.778: R1.2 24.38,40.75 | C12.+ C13.+ 21.97,48.9 C4.2
  Bottom 0.356: v7.39,40.84 7.62,40.64 | 6.35,43.43 6.86,42.93
  Bottom 1.27: 7.62,40.64 v7.62,38.86 | 6.35,43.43 6.35,51.05 16,51.05 v16.26,50.8 | 6.86,42.93 7.37,42.93 v7.39,40.84
VBUS  (via drill 0.6)
  Top 0.254: F2.1 89.69,12.61 | 89.69,12.61 C24.2 | 89.69,12.61 88.56,12.61 v88.39,12.45
  Bottom 0.254: v88.39,12.45 88.39,10.67 84.58,6.86 83.82,6.86 83.57,6.6 83.57,5.45 USB.1
VCC  (via drill 0.6)
  Top 0.254: U2.17 80.42,39.98 80.42,40.23 79.25,41.4 | 78.16,42.49 77.76,42.11 C20.2 | U5.8 74.65,36.3 v74.93,36.58 | v78.36,41.07 78.53,40.89 78.74,40.89 79.25,41.4 | v79.38,44.45 78.63,43.69 78.59,43.63 | U2.1 88.24,36.48 v88.44,35.33 R38.2 | v88.65,37.85 88.65,37.95 88.32,37.52 87.25,37.52 U2.3 U2.4 87.51,37.98 89.66,39.47 89.66,40.89 88.65,41.66 88.66,42.93 | 88.66,42.93 88.67,44.4 R4.2 88.75,45.92 R39.2 | U2.29 U2.30 85.36,34.81 v85.09,34.54 | U2.11 85.26,43.65 v84.38,44.4 | v90.3,42.75 89.91,42.93 88.66,42.93 | v76.99,46.79 75.95,48.08 R37.2 76,48.65 C23.2 | 79.25,41.4 78.16,42.49 | 78.59,43.63 78.7,43.12 78.16,42.49 | v73.41,31.75 74.93,31.75 R36.2 74.22,30.73 73.15,30.73 72.9,30.48 72.9,28.96 73.66,27.94 73.66,26.16 72.64,26.16 72.09,26.63 IC2.9 71.15,26.67 69.55,26.67 v69.22,26.9 | v65.56,25.63 65.53,26.92 65.53,27.18 64.76,27.93 IC2.18 62.74,27.93 62.74,29.72 62.99,30.45 64.78,30.45 64.84,37.3 | 36.29,50.81 C35.2 | v39.12,48.77 39.28,48.93 U9.6 | U8.7 38.81,42.67 40.64,42.67 | 40.64,42.67 v40.64,45.19 | 40.64,42.67 40.64,39.12 39.88,39.12 39.89,35.83 C18.1 37.53,34.16 R23.2 | 36.29,50.81 36.32,48.28 IC3.5 35.56,47.81 35.53,48.39 33.76,48.39 33.31,48.73 U10.8 32.51,48.8 32.51,49.28 32,49.78 30.99,49.78 30.95,49.77 C36.1 | R22.1 IC1.8 | IC1.8 61.07,37.3 | v50.82,41.78 v50.8,44.98 | v59.94,39.12 61.21,39.12 61.21,37.34 IC1.8 | 64.84,37.3 U22.16 | IC1.8 61.09,36.7 v61.16,36.55 | v64.06,36.55 64.84,37.3 | 78.59,43.63 78.47,43.74 77.97,43.74 C27.2 v76.91,44.12 | 16.56,11.14 16.51,11.05 | 12.7,15.34 U12.4 | v39.62,53.09 38.99,52.96 37.16,52.96 36.4,52.59 36.32,52.52 36.32,50.8 36.29,50.81
  Top 0.254: 36.29,50.81 37.59,50.81 C21.2
  Top 0.356: 20.36,11.39 D6.+ 20.57,11.58 | C32.2 16.66,11.41 | U12.3 12.19,15.12 | v36.2,32.51 R23.2
  Top 0.457: U12.3 U12.4 | 12.19,15.12 v12.19,14.02
  Top 0.61: U3.5 16.56,11.14 C32.2 17.91,12.45 19.3,12.45 20.36,11.39 | v20.55,14.1 20.57,11.58 | v12.19,14.02 12.17,13.21 13.21,12.19 13.21,11.05 13.21,6.88 | v7.11,15.75 6.58,15.75
  Top 1.016: 16.51,11.05 13.21,11.05 | 6.58,15.75 C2.2
  Top 1.27: v30.48,13.46 30.48,15 D8.2 28.82,18.66 U6.4 31.5,19.81 v31.5,24.38 | C2.2 2.46,15.75 J6.1
  Bottom 0.254: v78.36,41.07 75.84,41.07 75.84,38.3 74.93,37.34 v74.93,36.58 74.93,33.53 v73.41,31.75 | v79.38,44.45 v84.38,44.4 85.29,43.61 86.31,42.04 89.84,42.01 v90.3,42.75 | v88.65,37.85 v88.44,35.33 87.83,34.57 v85.09,34.54 | v76.91,44.12 v76.99,46.79 | v69.22,26.9 67.82,26.36 v65.56,25.63 | v39.62,53.09 39.62,50.55 v39.12,48.77 39.06,46.69 v40.64,45.19 42.16,43.94 44.42,44.98 v50.8,44.98 | v50.82,41.78 52.07,40.64 53.09,39.88 55.88,39.88 55.88,41.66 58.6,41.66 58.55,39.07 v59.94,39.12 | v61.16,36.55 v64.06,36.55
  Bottom 0.356: v31.5,24.38 31.5,25.4 36.17,25.43 v36.2,32.51
  Bottom 1.016: v12.19,14.02 8.13,13.97 7.11,13.97 v7.11,15.75
  Bottom 1.27: v20.55,14.1 K1.1 29.85,14.1 v30.48,13.46
  pour Top (isolate 0.406, no thermals): 12.04,15.39 12.04,10.52 10.92,9.4 10.92,4.32 11.68,3.56 14.48,3.56 14.73,3.81 14.73,11.18 12.88,13.67 12.88,15.54 12.75,15.65 12.09,15.65 12.19,15.49 12.19,15.24
VIN  (via drill 0.6)
  Top 1.676: Q5.3 v5.12,52.87
  Bottom 1.676: v5.12,52.87 J19.1
Y0  (via drill 0.6)
  Top 0.254: U22.15 64.62,37.95 64.36,37.95 63.27,37.95 63.27,35.81 64.01,35.31 v64.01,31.5
  Bottom 0.254: v64.01,31.5 64.26,18.8 U23.1
Y1  (via drill 0.6)
  Top 0.254: U22.14 64.51,38.6 62.86,38.61 62.86,34.93 62.94,31.37 62.18,29.79 v61.72,27.43 | v62.74,19.3 U21.1
  Bottom 0.254: v61.72,27.43 63.47,25.63 63.5,20.32 v62.74,19.3
Y2  (via drill 0.6)
  Top 0.254: v59.13,21.84 59.69,24.64 59.69,26.11 60.96,28.45 62.43,31.42 62.41,39.25 62.46,39.25 U22.13 | v59.21,18.67 v52.12,18.64
  Bottom 0.254: v59.13,21.84 v59.21,18.67 | v52.12,18.64 U24.1
Y3  (via drill 0.6)
  Top 0.254: U22.12 64.77,39.88 61.92,39.9 61.98,31.45 60.71,29.21 58.93,26.24 58.93,25.4 v57.66,21.84 | v57.66,17.02 U25.1
  Bottom 0.254: v57.66,21.84 v57.66,17.02
Y4  (via drill 0.6)
  Top 0.254: U22.11 64.35,40.55 61.92,43 v61.57,45.41
  Bottom 0.254: v61.57,45.41 60.71,44.2 55.14,44.15 U26.1
Y5
  Top 0.254: U27.1 52.58,45.47 52.58,46.23 52.83,46.48 62.48,46.48 62.48,43.18 64.52,41.15 64.77,41.15 U22.10
Y6  (via drill 0.6)
  Top 0.254: U22.9 v65.02,43.94
  Bottom 0.254: v65.02,43.94 65.02,44.07 U28.1
Y7  (via drill 0.6)
  Top 0.254: v63.75,43.18 63.75,45.21 U29.1 | v72.14,42.42 72.14,41.4 71.63,41.4 71.37,41.15 70.87,41.15 U22.7
  Bottom 0.254: v63.75,43.18 68.07,38.61 68.07,29.46 69.6,29.46 70.61,30.48 70.61,35.81 71.88,36.58 71.91,38.38 72.39,38.86 72.39,41.15 72.14,41.4 v72.14,42.42 72.14,41.91

## Text on the board
tNames: DNP | DNP | BATT | C9 | PWR | COM | RX | TX
bNames: LED (-) | (+) | ALT / 7555 / ENABLE | DIM / SHDN / OVERRIDE | R16 / BYPASS | 12V+ | 3.3V+ | STATUS / LED / ENABLE | NO | NC